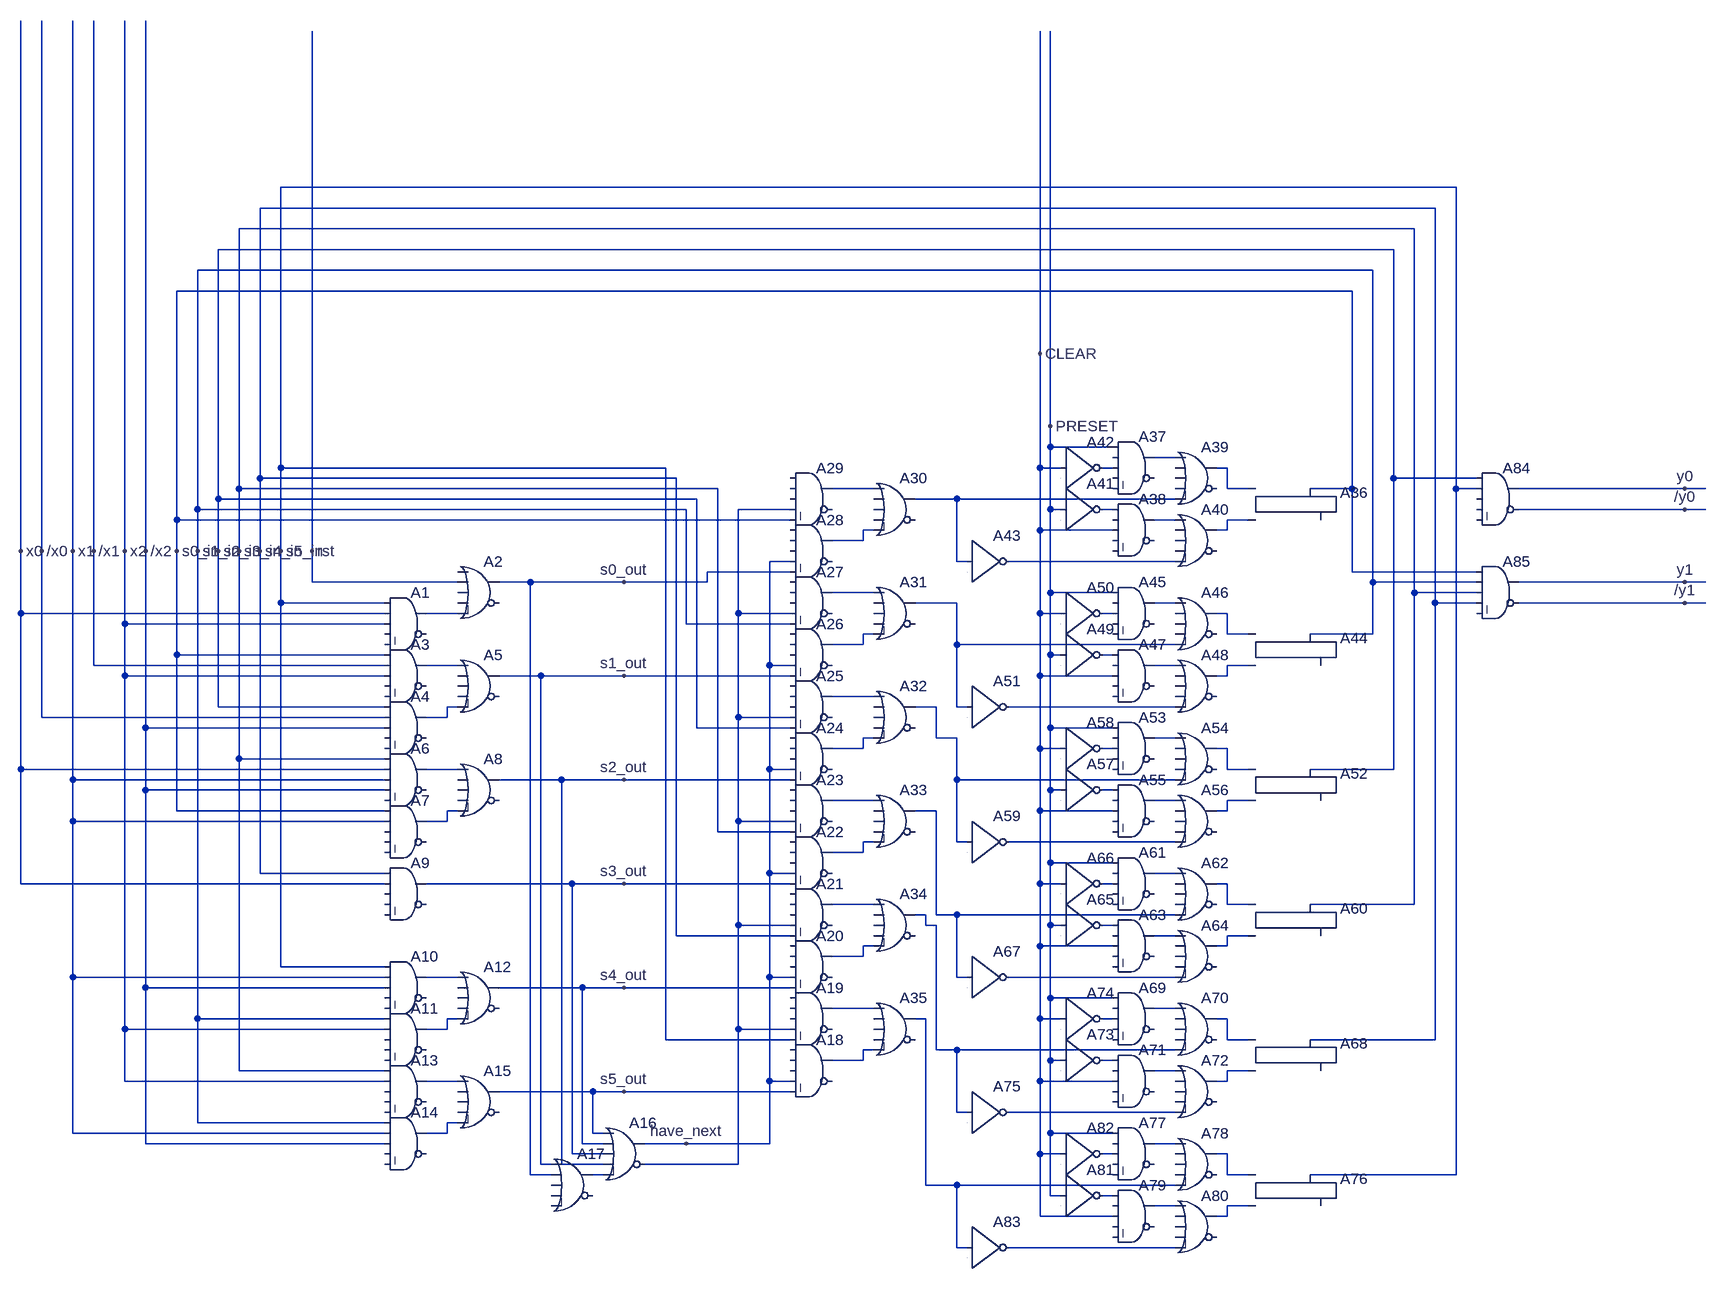
[diagram p0: schematic first_task_unar_sr.asc]
first_task_unar_sr.asc, the LTspice schematic file:
Version 4
SHEET 1 2308 1112
WIRE 1920 -544 112 -544
WIRE 1888 -512 80 -512
WIRE 1856 -480 48 -480
WIRE 1824 -448 16 -448
WIRE 1792 -416 -16 -416
WIRE 1760 -384 -48 -384
WIRE 1280 -288 1280 -784
WIRE 1296 -176 1296 -784
WIRE 1296 -144 1296 -176
WIRE 1392 -144 1296 -144
WIRE 1488 -128 1456 -128
WIRE 112 -112 112 -544
WIRE 704 -112 112 -112
WIRE 1280 -112 1280 -288
WIRE 1312 -112 1280 -112
WIRE 1392 -112 1376 -112
WIRE 1568 -112 1552 -112
WIRE 80 -96 80 -512
WIRE 720 -96 80 -96
WIRE 1824 -96 1824 -448
WIRE 1952 -96 1824 -96
WIRE 48 -80 48 -480
WIRE 784 -80 48 -80
WIRE 1024 -80 960 -80
WIRE 1568 -80 1568 -112
WIRE 1600 -80 1568 -80
WIRE 1760 -80 1760 -384
WIRE 1760 -80 1696 -80
WIRE 1920 -80 1920 -544
WIRE 1952 -80 1920 -80
WIRE 2272 -80 2016 -80
WIRE 2304 -80 2272 -80
WIRE 16 -64 16 -448
WIRE 752 -64 16 -64
WIRE 1152 -64 1088 -64
WIRE 1488 -64 1152 -64
WIRE -16 -48 -16 -416
WIRE 736 -48 -16 -48
WIRE 896 -48 816 -48
WIRE 1296 -48 1296 -144
WIRE 1312 -48 1296 -48
WIRE 1392 -48 1376 -48
WIRE 2272 -48 2016 -48
WIRE 2304 -48 2272 -48
WIRE -48 -32 -48 -384
WIRE 896 -32 -48 -32
WIRE 1488 -32 1456 -32
WIRE 1600 -32 1568 -32
WIRE 1024 -16 1008 -16
WIRE 1280 -16 1280 -112
WIRE 1392 -16 1280 -16
WIRE 1568 -16 1568 -32
WIRE 1568 -16 1552 -16
WIRE 1008 0 1008 -16
WIRE 1008 0 960 0
WIRE -288 16 -288 -800
WIRE -256 16 -256 -800
WIRE -208 16 -208 -800
WIRE -176 16 -176 -800
WIRE -128 16 -128 -800
WIRE -96 16 -96 -800
WIRE -48 16 -48 -32
WIRE -16 16 -16 -48
WIRE 16 16 16 -64
WIRE 48 16 48 -80
WIRE 80 16 80 -96
WIRE 112 16 112 -112
WIRE 160 16 160 -784
WIRE 896 32 864 32
WIRE 1152 32 1152 -64
WIRE 1168 32 1152 32
WIRE 1488 32 1232 32
WIRE 896 48 768 48
WIRE 1760 48 1760 -80
WIRE 1952 48 1760 48
WIRE 160 64 160 16
WIRE 384 64 160 64
WIRE 496 64 448 64
WIRE 640 64 496 64
WIRE 768 64 768 48
WIRE 768 64 640 64
WIRE 1792 64 1792 -416
WIRE 1952 64 1792 64
WIRE 2272 64 2016 64
WIRE 2304 64 2272 64
WIRE 1024 80 960 80
WIRE 1296 80 1296 -48
WIRE 1392 80 1296 80
WIRE 1856 80 1856 -480
WIRE 1952 80 1856 80
WIRE 112 96 112 16
WIRE 272 96 112 96
WIRE 1152 96 1088 96
WIRE 1488 96 1456 96
WIRE 1888 96 1888 -512
WIRE 1952 96 1888 96
WIRE 2272 96 2016 96
WIRE 2304 96 2272 96
WIRE -288 112 -288 16
WIRE 272 112 -288 112
WIRE 384 112 336 112
WIRE 816 112 816 -48
WIRE 896 112 816 112
WIRE 1280 112 1280 -16
WIRE 1312 112 1280 112
WIRE 1392 112 1376 112
WIRE 1568 112 1552 112
WIRE -128 128 -128 16
WIRE 272 128 -128 128
WIRE 736 128 736 -48
WIRE 896 128 736 128
WIRE 1024 144 1008 144
WIRE 1568 144 1568 112
WIRE 1600 144 1568 144
WIRE 1792 144 1792 64
WIRE 1792 144 1696 144
WIRE 1008 160 1008 144
WIRE 1008 160 960 160
WIRE 1152 160 1152 96
WIRE 1488 160 1152 160
WIRE -48 176 -48 16
WIRE 272 176 -48 176
WIRE 1296 176 1296 80
WIRE 1312 176 1296 176
WIRE 1392 176 1376 176
WIRE -176 192 -176 16
WIRE 272 192 -176 192
WIRE 384 192 336 192
WIRE 864 192 864 32
WIRE 896 192 864 192
WIRE 1488 192 1456 192
WIRE 1600 192 1568 192
WIRE -128 208 -128 128
WIRE 272 208 -128 208
WIRE 512 208 448 208
WIRE 640 208 512 208
WIRE 896 208 640 208
WIRE 1280 208 1280 112
WIRE 1392 208 1280 208
WIRE 1568 208 1568 192
WIRE 1568 208 1552 208
WIRE 1024 240 960 240
WIRE 16 256 16 16
WIRE 272 256 16 256
WIRE 384 256 368 256
WIRE 1120 256 1088 256
WIRE 1152 256 1152 160
WIRE 1168 256 1152 256
WIRE 1488 256 1232 256
WIRE -256 272 -256 16
WIRE 272 272 -256 272
WIRE 368 272 368 256
WIRE 368 272 336 272
WIRE 816 272 816 112
WIRE 896 272 816 272
WIRE -96 288 -96 16
WIRE 272 288 -96 288
WIRE 752 288 752 -64
WIRE 896 288 752 288
WIRE 1296 288 1296 176
WIRE 1392 288 1296 288
WIRE 1024 304 1008 304
WIRE 1120 304 1120 256
WIRE 1152 304 1120 304
WIRE 1488 304 1456 304
WIRE 1008 320 1008 304
WIRE 1008 320 960 320
WIRE 1280 320 1280 208
WIRE 1312 320 1280 320
WIRE 1392 320 1376 320
WIRE 1568 320 1552 320
WIRE 48 336 48 16
WIRE 272 336 48 336
WIRE -288 352 -288 112
WIRE 272 352 -288 352
WIRE 384 352 336 352
WIRE 864 352 864 192
WIRE 896 352 864 352
WIRE 1568 352 1568 320
WIRE 1600 352 1568 352
WIRE 1824 352 1824 -96
WIRE 1824 352 1696 352
WIRE -208 368 -208 16
WIRE 272 368 -208 368
WIRE 544 368 448 368
WIRE 640 368 544 368
WIRE 896 368 640 368
WIRE 1152 368 1152 304
WIRE 1488 368 1152 368
WIRE -96 384 -96 288
WIRE 272 384 -96 384
WIRE 1296 384 1296 288
WIRE 1312 384 1296 384
WIRE 1392 384 1376 384
WIRE 1024 400 960 400
WIRE 1488 400 1456 400
WIRE 1600 400 1568 400
WIRE -48 416 -48 176
WIRE 272 416 -48 416
WIRE 384 416 368 416
WIRE 1120 416 1088 416
WIRE 1280 416 1280 320
WIRE 1392 416 1280 416
WIRE 1568 416 1568 400
WIRE 1568 416 1552 416
WIRE -208 432 -208 368
WIRE 272 432 -208 432
WIRE 368 432 368 416
WIRE 368 432 336 432
WIRE 816 432 816 272
WIRE 896 432 816 432
WIRE 784 448 784 -80
WIRE 896 448 784 448
WIRE 1024 464 1008 464
WIRE 1152 464 1152 368
WIRE 1168 464 1152 464
WIRE 1488 464 1232 464
WIRE 1008 480 1008 464
WIRE 1008 480 960 480
WIRE 1296 496 1296 384
WIRE 1392 496 1296 496
WIRE 80 512 80 16
WIRE 272 512 80 512
WIRE 864 512 864 352
WIRE 896 512 864 512
WIRE 1488 512 1456 512
WIRE -288 528 -288 352
WIRE 272 528 -288 528
WIRE 560 528 336 528
WIRE 640 528 560 528
WIRE 896 528 640 528
WIRE 1280 528 1280 416
WIRE 1312 528 1280 528
WIRE 1392 528 1376 528
WIRE 1568 528 1552 528
WIRE 1024 560 960 560
WIRE 1568 560 1568 528
WIRE 1600 560 1568 560
WIRE 1856 560 1856 80
WIRE 1856 560 1696 560
WIRE 1104 576 1088 576
WIRE 1120 576 1120 416
WIRE 1152 576 1120 576
WIRE 1488 576 1152 576
WIRE 816 592 816 432
WIRE 896 592 816 592
WIRE 1104 592 1104 576
WIRE 1120 592 1104 592
WIRE 1296 592 1296 496
WIRE 1312 592 1296 592
WIRE 1392 592 1376 592
WIRE 720 608 720 -96
WIRE 896 608 720 608
WIRE 1488 608 1456 608
WIRE 1600 608 1568 608
WIRE 1024 624 1008 624
WIRE 1280 624 1280 528
WIRE 1392 624 1280 624
WIRE 1568 624 1568 608
WIRE 1568 624 1552 624
WIRE 1008 640 1008 624
WIRE 1008 640 960 640
WIRE 112 656 112 96
WIRE 272 656 112 656
WIRE -208 672 -208 432
WIRE 272 672 -208 672
WIRE 384 672 336 672
WIRE 864 672 864 512
WIRE 896 672 864 672
WIRE 1152 672 1152 576
WIRE 1168 672 1152 672
WIRE 1488 672 1232 672
WIRE -96 688 -96 384
WIRE 272 688 -96 688
WIRE 576 688 448 688
WIRE 640 688 576 688
WIRE 896 688 640 688
WIRE 1296 704 1296 592
WIRE 1392 704 1296 704
WIRE 1024 720 960 720
WIRE 1488 720 1456 720
WIRE -16 736 -16 16
WIRE 272 736 -16 736
WIRE 384 736 368 736
WIRE 1104 736 1088 736
WIRE 1280 736 1280 624
WIRE 1312 736 1280 736
WIRE 1392 736 1376 736
WIRE 1568 736 1552 736
WIRE -128 752 -128 208
WIRE 272 752 -128 752
WIRE 368 752 368 736
WIRE 368 752 336 752
WIRE 816 752 816 592
WIRE 896 752 816 752
WIRE 704 768 704 -112
WIRE 896 768 704 768
WIRE 1568 768 1568 736
WIRE 1600 768 1568 768
WIRE 1888 768 1888 96
WIRE 1888 768 1696 768
WIRE 1024 784 1008 784
WIRE 1120 784 1120 592
WIRE 1152 784 1120 784
WIRE 1488 784 1152 784
WIRE 1008 800 1008 784
WIRE 1008 800 960 800
WIRE 1296 800 1296 704
WIRE 1312 800 1296 800
WIRE 1392 800 1376 800
WIRE 48 816 48 336
WIRE 272 816 48 816
WIRE 1488 816 1456 816
WIRE 1600 816 1568 816
WIRE -128 832 -128 752
WIRE 272 832 -128 832
WIRE 384 832 336 832
WIRE 864 832 864 672
WIRE 896 832 864 832
WIRE 1280 832 1280 736
WIRE 1392 832 1280 832
WIRE 1568 832 1568 816
WIRE 1568 832 1552 832
WIRE 592 848 448 848
WIRE 640 848 592 848
WIRE 896 848 640 848
WIRE 1152 880 1152 784
WIRE 1168 880 1152 880
WIRE 1488 880 1232 880
WIRE -16 896 -16 736
WIRE 272 896 -16 896
WIRE 384 896 368 896
WIRE -208 912 -208 672
WIRE 272 912 -208 912
WIRE 368 912 368 896
WIRE 368 912 336 912
WIRE 592 912 592 848
WIRE 608 912 592 912
WIRE 1296 912 1296 800
WIRE 1392 912 1296 912
WIRE -96 928 -96 688
WIRE 272 928 -96 928
WIRE 576 928 576 688
WIRE 608 928 576 928
WIRE 736 928 672 928
WIRE 864 928 864 832
WIRE 864 928 736 928
WIRE 1488 928 1456 928
WIRE 560 944 560 528
WIRE 608 944 560 944
WIRE 1280 944 1280 832
WIRE 1312 944 1280 944
WIRE 1392 944 1376 944
WIRE 1568 944 1552 944
WIRE 512 960 512 208
WIRE 528 960 512 960
WIRE 544 960 544 368
WIRE 608 960 544 960
WIRE 816 960 816 752
WIRE 816 960 672 960
WIRE 496 976 496 64
WIRE 528 976 496 976
WIRE 608 976 592 976
WIRE 1568 976 1568 944
WIRE 1600 976 1568 976
WIRE 1920 976 1920 -80
WIRE 1920 976 1696 976
WIRE 1104 992 1104 736
WIRE 1152 992 1104 992
WIRE 1488 992 1152 992
WIRE 1296 1008 1296 912
WIRE 1312 1008 1296 1008
WIRE 1392 1008 1376 1008
WIRE 1488 1024 1456 1024
WIRE 1600 1024 1568 1024
WIRE 1280 1040 1280 944
WIRE 1392 1040 1280 1040
WIRE 1568 1040 1568 1024
WIRE 1568 1040 1552 1040
WIRE 1152 1088 1152 992
WIRE 1168 1088 1152 1088
WIRE 1488 1088 1232 1088
FLAG -288 16 x0
FLAG -256 16 /x0
FLAG -208 16 x1
FLAG -176 16 /x1
FLAG -128 16 x2
FLAG -96 16 /x2
FLAG -48 16 s0_in
FLAG -16 16 s1_in
FLAG 16 16 s2_in
FLAG 48 16 s3_in
FLAG 80 16 s4_in
FLAG 112 16 s5_in
FLAG 160 16 rst
FLAG 640 64 s0_out
FLAG 640 208 s1_out
FLAG 640 368 s2_out
FLAG 640 528 s3_out
FLAG 640 688 s4_out
FLAG 640 848 s5_out
FLAG 736 928 have_next
FLAG 1296 -176 PRESET
FLAG 1280 -288 CLEAR
FLAG 2272 -80 y0
FLAG 2272 -48 /y0
FLAG 2272 64 y1
FLAG 2272 96 /y1
SYMBOL Digital\\and 304 64 R0
SYMATTR InstName A1
SYMBOL Digital\\or 416 16 R0
SYMATTR InstName A2
SYMBOL Digital\\and 304 144 R0
SYMATTR InstName A3
SYMBOL Digital\\and 304 224 R0
SYMATTR InstName A4
SYMBOL Digital\\or 416 160 R0
SYMATTR InstName A5
SYMBOL Digital\\and 304 304 R0
SYMATTR InstName A6
SYMBOL Digital\\and 304 384 R0
SYMATTR InstName A7
SYMBOL Digital\\or 416 320 R0
SYMATTR InstName A8
SYMBOL Digital\\and 304 480 R0
SYMATTR InstName A9
SYMBOL Digital\\and 304 624 R0
SYMATTR InstName A10
SYMBOL Digital\\and 304 704 R0
SYMATTR InstName A11
SYMBOL Digital\\or 416 640 R0
SYMATTR InstName A12
SYMBOL Digital\\and 304 784 R0
SYMATTR InstName A13
SYMBOL Digital\\and 304 864 R0
SYMATTR InstName A14
SYMBOL Digital\\or 416 800 R0
SYMATTR InstName A15
SYMBOL Digital\\or 640 880 R0
SYMATTR InstName A16
SYMBOL Digital\\or 560 928 R0
SYMATTR InstName A17
SYMBOL Digital\\and 928 752 R0
SYMATTR InstName A18
SYMBOL Digital\\and 928 672 R0
SYMATTR InstName A19
SYMBOL Digital\\and 928 592 R0
SYMATTR InstName A20
SYMBOL Digital\\and 928 512 R0
SYMATTR InstName A21
SYMBOL Digital\\and 928 432 R0
SYMATTR InstName A22
SYMBOL Digital\\and 928 352 R0
SYMATTR InstName A23
SYMBOL Digital\\and 928 272 R0
SYMATTR InstName A24
SYMBOL Digital\\and 928 192 R0
SYMATTR InstName A25
SYMBOL Digital\\and 928 112 R0
SYMATTR InstName A26
SYMBOL Digital\\and 928 32 R0
SYMATTR InstName A27
SYMBOL Digital\\and 928 -48 R0
SYMATTR InstName A28
SYMBOL Digital\\and 928 -128 R0
SYMATTR InstName A29
SYMBOL Digital\\or 1056 -112 R0
SYMATTR InstName A30
SYMBOL Digital\\or 1056 48 R0
SYMATTR InstName A31
SYMBOL Digital\\or 1056 208 R0
SYMATTR InstName A32
SYMBOL Digital\\or 1056 368 R0
SYMATTR InstName A33
SYMBOL Digital\\or 1056 528 R0
SYMATTR InstName A34
SYMBOL Digital\\or 1056 688 R0
SYMATTR InstName A35
SYMBOL Digital\\srflop 1648 -128 R0
SYMATTR InstName A36
SYMBOL Digital\\and 1424 -176 R0
SYMATTR InstName A37
SYMBOL Digital\\or 1520 -160 R0
SYMATTR InstName A39
SYMBOL Digital\\and 1424 -80 R0
SYMATTR InstName A38
SYMBOL Digital\\or 1520 -64 R0
SYMATTR InstName A40
SYMBOL Digital\\inv 1312 -112 R0
SYMATTR InstName A41
SYMBOL Digital\\inv 1312 -176 R0
SYMATTR InstName A42
SYMBOL Digital\\inv 1168 -32 R0
SYMATTR InstName A43
SYMBOL Digital\\srflop 1648 96 R0
SYMATTR InstName A44
SYMBOL Digital\\and 1424 48 R0
SYMATTR InstName A45
SYMBOL Digital\\or 1520 64 R0
SYMATTR InstName A46
SYMBOL Digital\\and 1424 144 R0
SYMATTR InstName A47
SYMBOL Digital\\or 1520 160 R0
SYMATTR InstName A48
SYMBOL Digital\\inv 1312 112 R0
SYMATTR InstName A49
SYMBOL Digital\\inv 1312 48 R0
SYMATTR InstName A50
SYMBOL Digital\\inv 1168 192 R0
SYMATTR InstName A51
SYMBOL Digital\\srflop 1648 304 R0
SYMATTR InstName A52
SYMBOL Digital\\and 1424 256 R0
SYMATTR InstName A53
SYMBOL Digital\\or 1520 272 R0
SYMATTR InstName A54
SYMBOL Digital\\and 1424 352 R0
SYMATTR InstName A55
SYMBOL Digital\\or 1520 368 R0
SYMATTR InstName A56
SYMBOL Digital\\inv 1312 320 R0
SYMATTR InstName A57
SYMBOL Digital\\inv 1312 256 R0
SYMATTR InstName A58
SYMBOL Digital\\inv 1168 400 R0
SYMATTR InstName A59
SYMBOL Digital\\srflop 1648 512 R0
SYMATTR InstName A60
SYMBOL Digital\\and 1424 464 R0
SYMATTR InstName A61
SYMBOL Digital\\or 1520 480 R0
SYMATTR InstName A62
SYMBOL Digital\\and 1424 560 R0
SYMATTR InstName A63
SYMBOL Digital\\or 1520 576 R0
SYMATTR InstName A64
SYMBOL Digital\\inv 1312 528 R0
SYMATTR InstName A65
SYMBOL Digital\\inv 1312 464 R0
SYMATTR InstName A66
SYMBOL Digital\\inv 1168 608 R0
SYMATTR InstName A67
SYMBOL Digital\\srflop 1648 720 R0
SYMATTR InstName A68
SYMBOL Digital\\and 1424 672 R0
SYMATTR InstName A69
SYMBOL Digital\\or 1520 688 R0
SYMATTR InstName A70
SYMBOL Digital\\and 1424 768 R0
SYMATTR InstName A71
SYMBOL Digital\\or 1520 784 R0
SYMATTR InstName A72
SYMBOL Digital\\inv 1312 736 R0
SYMATTR InstName A73
SYMBOL Digital\\inv 1312 672 R0
SYMATTR InstName A74
SYMBOL Digital\\inv 1168 816 R0
SYMATTR InstName A75
SYMBOL Digital\\srflop 1648 928 R0
SYMATTR InstName A76
SYMBOL Digital\\and 1424 880 R0
SYMATTR InstName A77
SYMBOL Digital\\or 1520 896 R0
SYMATTR InstName A78
SYMBOL Digital\\and 1424 976 R0
SYMATTR InstName A79
SYMBOL Digital\\or 1520 992 R0
SYMATTR InstName A80
SYMBOL Digital\\inv 1312 944 R0
SYMATTR InstName A81
SYMBOL Digital\\inv 1312 880 R0
SYMATTR InstName A82
SYMBOL Digital\\inv 1168 1024 R0
SYMATTR InstName A83
SYMBOL Digital\\and 1984 -128 R0
SYMATTR InstName A84
SYMBOL Digital\\and 1984 16 R0
SYMATTR InstName A85

The netlist it stands for:
* first_task_unar_sr.asc
A1 s5_in x0 x2 0 0 0 N015 0 AND
A2 0 rst 0 0 N015 0 s0_out 0 OR
A3 s0_in /x1 x2 0 0 0 N020 0 AND
A4 s2_in /x0 /x2 0 0 0 N024 0 AND
A5 N020 0 0 0 N024 0 s1_out 0 OR
A6 s3_in x0 x1 /x2 0 0 N031 0 AND
A7 s0_in x1 0 0 0 0 N036 0 AND
A8 N031 0 0 0 N036 0 s2_out 0 OR
A9 s4_in x0 0 0 0 0 s3_out 0 AND
A10 s5_in x1 /x2 0 0 0 N049 0 AND
A11 s1_in x2 0 0 0 0 N053 0 AND
A12 N049 0 0 0 N053 0 s4_out 0 OR
A13 s3_in x2 0 0 0 0 N061 0 AND
A14 s1_in x1 /x2 0 0 0 N063 0 AND
A15 N061 0 0 0 N063 0 s5_out 0 OR
A16 s5_out s4_out s3_out s2_out N067 N006 have_next 0 OR
A17 s1_out s0_out 0 0 0 0 N067 0 OR
A18 0 0 0 have_next s5_out 0 N057 0 AND
A19 0 0 0 N006 s5_in 0 N051 0 AND
A20 0 0 0 have_next s4_out 0 N048 0 AND
A21 0 0 0 N006 s4_in 0 N043 0 AND
A22 0 0 0 have_next s3_out 0 N038 0 AND
A23 0 0 0 N006 s3_in 0 N033 0 AND
A24 0 0 0 have_next s2_out 0 N027 0 AND
A25 0 0 0 N006 s2_in 0 N023 0 AND
A26 0 0 0 have_next s1_out 0 N018 0 AND
A27 0 0 0 N006 s1_in 0 N012 0 AND
A28 0 0 0 have_next s0_out 0 N010 0 AND
A29 0 0 0 N006 s0_in 0 N004 0 AND
A30 N004 0 0 0 N010 0 N005 0 OR
A31 N012 0 0 0 N018 0 N013 0 OR
A32 N023 0 0 0 N027 0 N025 0 OR
A33 N033 0 0 0 N038 0 N037 0 OR
A34 N043 0 0 0 N048 0 N044 0 OR
A35 N051 0 0 0 N057 0 N054 0 OR
A36 N003 N009 0 0 0 0 s0_in 0 SRFLOP
A37 PRESET 0 N002 0 0 0 N001 0 AND
A39 N001 0 0 0 N005 0 N003 0 OR
A38 N007 0 CLEAR 0 0 0 N008 0 AND
A40 N008 0 0 0 N011 0 N009 0 OR
A41 PRESET 0 0 0 0 N007 0 0 BUF
A42 CLEAR 0 0 0 0 N002 0 0 BUF
A43 N005 0 0 0 0 N011 0 0 BUF
A44 N017 N022 0 0 0 0 s1_in 0 SRFLOP
A45 PRESET 0 N016 0 0 0 N014 0 AND
A46 N014 0 0 0 N013 0 N017 0 OR
A47 N019 0 CLEAR 0 0 0 N021 0 AND
A48 N021 0 0 0 N026 0 N022 0 OR
A49 PRESET 0 0 0 0 N019 0 0 BUF
A50 CLEAR 0 0 0 0 N016 0 0 BUF
A51 N013 0 0 0 0 N026 0 0 BUF
A52 N030 N035 0 0 0 0 s2_in 0 SRFLOP
A53 PRESET 0 N029 0 0 0 N028 0 AND
A54 N028 0 0 0 N025 0 N030 0 OR
A55 N032 0 CLEAR 0 0 0 N034 0 AND
A56 N034 0 0 0 N039 0 N035 0 OR
A57 PRESET 0 0 0 0 N032 0 0 BUF
A58 CLEAR 0 0 0 0 N029 0 0 BUF
A59 N025 0 0 0 0 N039 0 0 BUF
A60 N042 N047 0 0 0 0 s3_in 0 SRFLOP
A61 PRESET 0 N041 0 0 0 N040 0 AND
A62 N040 0 0 0 N037 0 N042 0 OR
A63 N045 0 CLEAR 0 0 0 N046 0 AND
A64 N046 0 0 0 N050 0 N047 0 OR
A65 PRESET 0 0 0 0 N045 0 0 BUF
A66 CLEAR 0 0 0 0 N041 0 0 BUF
A67 N037 0 0 0 0 N050 0 0 BUF
A68 N056 N060 0 0 0 0 s4_in 0 SRFLOP
A69 PRESET 0 N055 0 0 0 N052 0 AND
A70 N052 0 0 0 N044 0 N056 0 OR
A71 N058 0 CLEAR 0 0 0 N059 0 AND
A72 N059 0 0 0 N062 0 N060 0 OR
A73 PRESET 0 0 0 0 N058 0 0 BUF
A74 CLEAR 0 0 0 0 N055 0 0 BUF
A75 N044 0 0 0 0 N062 0 0 BUF
A76 N066 N070 0 0 0 0 s5_in 0 SRFLOP
A77 PRESET 0 N065 0 0 0 N064 0 AND
A78 N064 0 0 0 N054 0 N066 0 OR
A79 N068 0 CLEAR 0 0 0 N069 0 AND
A80 N069 0 0 0 N071 0 N070 0 OR
A81 PRESET 0 0 0 0 N068 0 0 BUF
A82 CLEAR 0 0 0 0 N065 0 0 BUF
A83 N054 0 0 0 0 N071 0 0 BUF
A84 s2_in s5_in 0 0 0 /y0 y0 0 AND
A85 s0_in s1_in s3_in s4_in 0 /y1 y1 0 AND
.backanno
.end